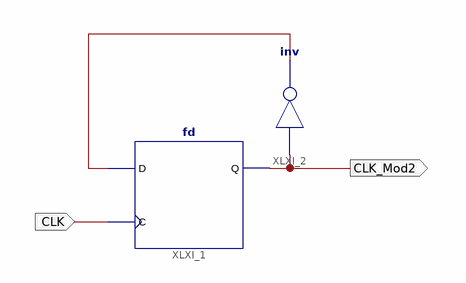
[diagram p0: schematic sheet 1]
// Xilinx ISE schematic Mod2.sch (spartan6) as structural Verilog: 2 symbols, 2 ports
module Mod2 (
  input  CLK,
  output CLK_Mod2
);

  wire XLXN_4;

  fd XLXI_1 (.C(CLK), .D(XLXN_4), .Q(CLK_Mod2));
  not XLXI_2 (XLXN_4, CLK_Mod2);
endmodule
